# EAGLE design schematGłówny (EAGLE 8.7.0)
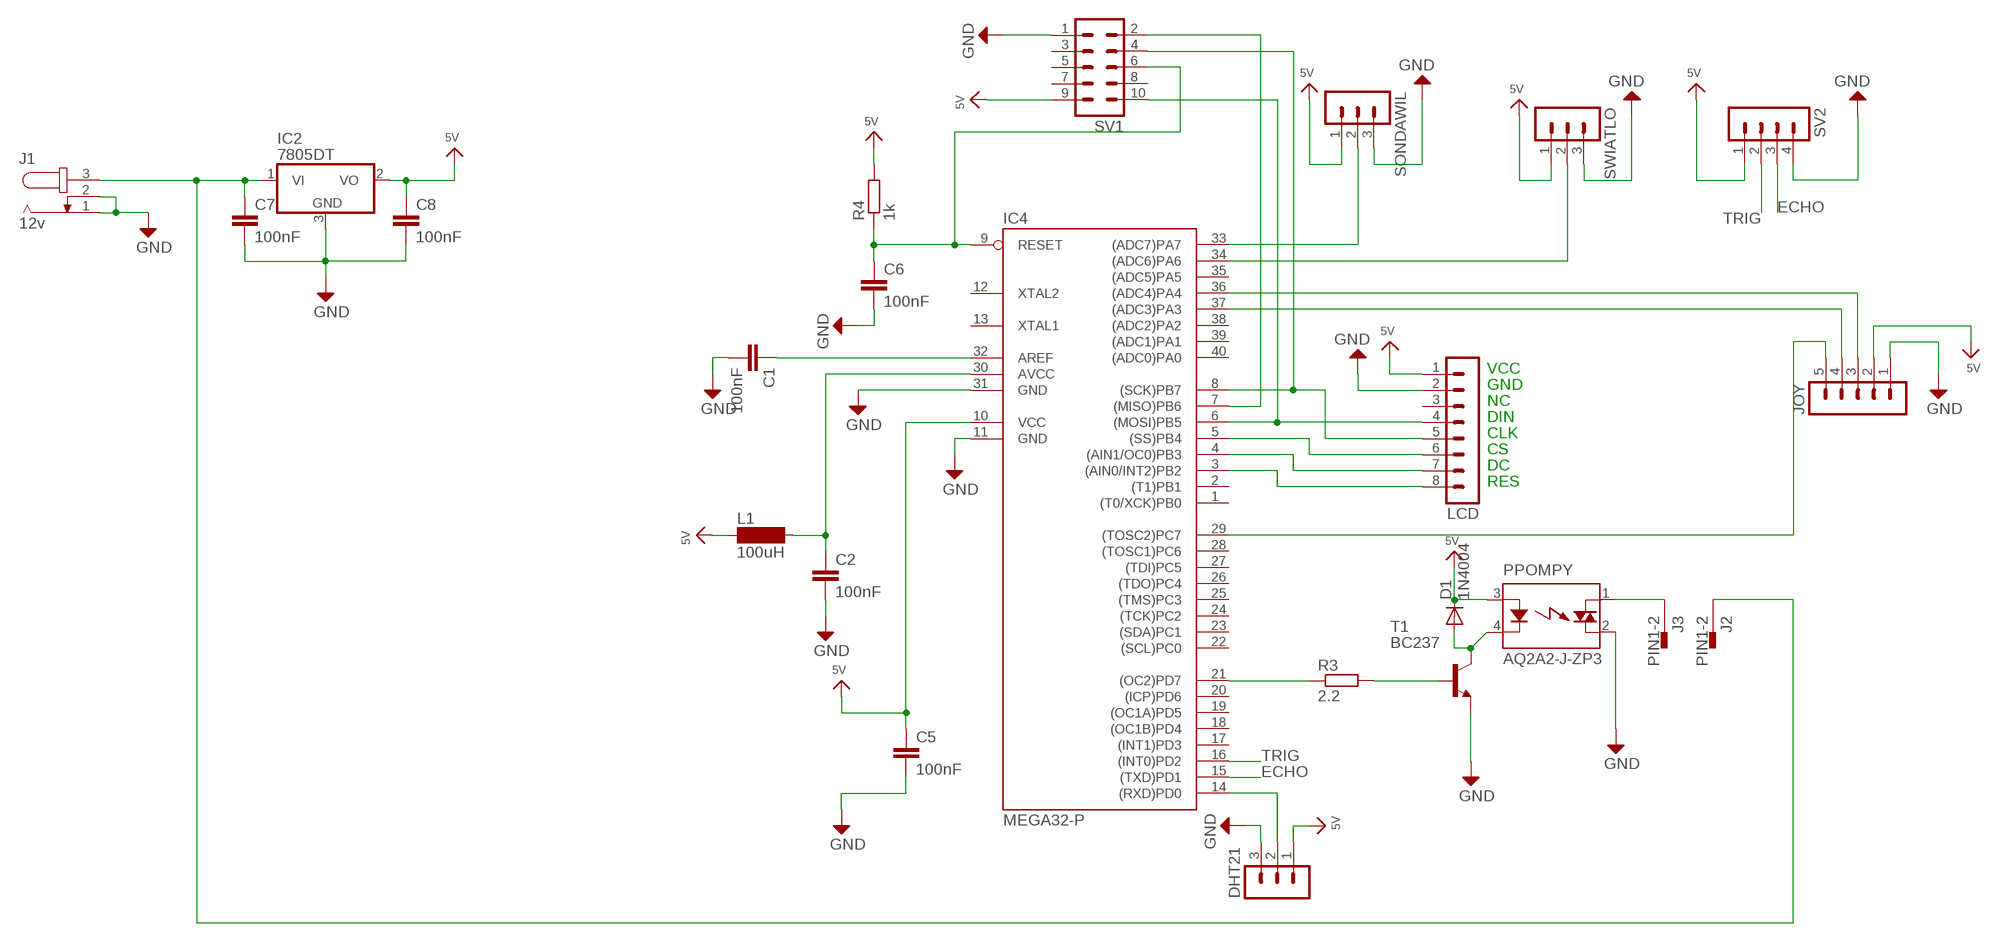
[diagram p0: schematic, sheet 1]

## Parts
C1  100nF  C2.5/6  [C2.5-6]
C2  100nF  C2.5/6  [C2.5-6]
C5  100nF  C2.5/6  [C2.5-6]
C6  100nF  C2.5/6  [C2.5-6]
C7  100nF  C2.5/6  [C2.5-6]
C8  100nF  C2.5/6  [C2.5-6]
D1  1N4004  [DO41-10]
DHT21  MA03-1  [MA03-1]
IC2  7805DT  [TO252]
IC4  MEGA32-P  [DIL40]
J1  12v  JACK-PLUG1  [SPC4078]
J2  PIN1-2  [62221]
J3  PIN1-2  [62221]
JOY  MA05-1  [MA05-1]
L1  100uH  BS75  [BS75]
LCD  MA08-1  [MA08-1]
PPOMPY  AQ2A2-J-ZP3  [AQ1-FLAT]
R3  2.2  R-EU_0207/15  [0207/15]
R4  1k  R-EU_0207/15  [0207/15]
SONDAWIL  MA03-1  [MA03-1]
SV1  MA05-2  [MA05-2]
SV2  MA04-1  [MA04-1]
SWIATLO  MA03-1  [MA03-1]
T1  BC237  [TO92]

## Nets
ECHO: IC4.15((TXD)PD1) SV2.3
GND: C1.2 C2.2 C5.2 C6.2 C7.2 C8.2 DHT21.3 IC2.3(GND) IC4.11(GND) IC4.31(GND) J1.1 J1.2 JOY.1 LCD.2 PPOMPY.2(DS2) SONDAWIL.3 SV1.1 SV2.4 SWIATLO.3 T1.1(E)
N$2: C6.1 IC4.9(RESET) R4.1 SV1.6
N$3: IC4.6((MOSI)PB5) LCD.4 SV1.10
N$4: C1.1 IC4.32(AREF)
N$5: C2.1 IC4.30(AVCC) L1.2
N$6: IC4.8((SCK)PB7) LCD.5 SV1.4
N$7: IC4.5((SS)PB4) LCD.6
N$8: IC4.4((AIN1/OC0)PB3) LCD.7
N$9: IC4.3((AIN0/INT2)PB2) LCD.8
N$10: DHT21.2 IC4.14((RXD)PD0)
N$12: IC4.33((ADC7)PA7) SONDAWIL.2
N$13: IC4.34((ADC6)PA6) SWIATLO.2
N$14: IC4.21((OC2)PD7) R3.1
N$15: R3.2 T1.2(B)
N$16: IC4.29((TOSC2)PC7) JOY.5
N$17: IC4.37((ADC3)PA3) JOY.4
N$18: IC4.36((ADC4)PA4) JOY.3
N$19: D1.A PPOMPY.4(K) T1.3(C)
N$20: IC4.7((MISO)PB6) SV1.2
N$22: J3.1 PPOMPY.1(DS1)
N$24: C7.1 IC2.1(VI) J1.3 J2.1
TRIG: IC4.16((INT0)PD2) SV2.2
VCC: C5.1 C8.1 D1.C DHT21.1 IC2.2(VO) IC4.10(VCC) JOY.2 L1.1 LCD.1 PPOMPY.3(A) R4.2 SONDAWIL.1 SV1.9 SV2.1 SWIATLO.1 ; supply symbol labelled 5V
Unconnected: IC4.1((T0/XCK)PB0) IC4.2((T1)PB1) IC4.12(XTAL2) IC4.13(XTAL1) IC4.17((INT1)PD3) IC4.18((OC1B)PD4) IC4.19((OC1A)PD5) IC4.20((ICP)PD6) IC4.22((SCL)PC0) IC4.23((SDA)PC1) IC4.24((TCK)PC2) IC4.25((TMS)PC3) IC4.26((TDO)PC4) IC4.27((TDI)PC5) IC4.28((TOSC1)PC6) IC4.35((ADC5)PA5) IC4.38((ADC2)PA2) IC4.39((ADC1)PA1) IC4.40((ADC0)PA0) LCD.3 SV1.3 SV1.5 SV1.7 SV1.8

## Notes on the sheet
- VCC
- GND
- NC
- DIN
- CLK
- CS
- DC
- RES

## Library data of the parts
C1 C2 C5-C8 = capacitor-wima:C: CAPACITOR naming: grid - package width
D1 = diode:1N4004: DIODE general purpose rectifier, 1 A
DHT21 SONDAWIL SWIATLO = con-lstb:MA03-1: PIN HEADER; OC_FARNELL: unknown; OC_NEWARK: unknown
IC2 = linear:78*: Positive VOLTAGE REGULATOR Source: http://cache.national.com/ds/LM/LM78L05.pdf http://www.fairchildsemi.com/ds/LM/LM7805.pdf
IC4 = atmel:MEGA32-P: MICROCONTROLLER 32 Kbytes FLASH 2 Kbytes SRAM 1 Kbytes EEPROM USART 8-channel 10 bit ADC Source: www.atmel.com .. doc2503.pdf; MPN: ATMEGA32-16PU; OC_FARNELL: 1661729; OC_NEWARK: 51P1794
J1 = con-jack:JACK-PLUG: DC POWER JACK Power Jack, DC, Right Angle, Through Hole, Rated 5A at 16VDC, PC Terminals Distributor: Farnell (www.Farnell.de) Drawing: 84N1161.pdf / 84N1162.pdf Manufacturer: SPC Technology (www.spctechnology.com) Type: SPC4077 / SPC 4078; OC_FARNELL: unknown; OC_NEWARK: unknown
J2 J3 = con-faston:PIN1-2: CONN TAB FASTON BRASS .187 PCB TAB, FSSTON, DUAL STAKE, .187 SERIES Digi-Key Part Number: A24734CT-ND Source: Tyco Electronics Corporation .. ENG_CD_62221_R.pdf http://search.digikey.com/scripts/DkSearch/dksus.dll?Detail&name=A24734CT-ND; MF: TYCO ELECTRONICS; MPN: 62221-1; OC_FARNELL: unknown; OC_NEWARK: 16H2318
JOY = con-lstb:MA05-1: PIN HEADER; OC_FARNELL: unknown; OC_NEWARK: unknown
L1 = inductor-neosid:BS: INDUCTOR nominal inductance, magnetically screened; OC_FARNELL: unknown; OC_NEWARK: unknown
LCD = con-lstb:MA08-1: PIN HEADER; OC_FARNELL: unknown; OC_NEWARK: unknown
PPOMPY = relay:AQ?: SOLID STATE RELAY NAiS Source: http://www.mew-europe.com/.. en_ds_61601_0000.pdf; MPN: AQ2A2-ZP3/28VDC; OC_FARNELL: 1163552; OC_NEWARK: 13P1232
R3 R4 = rcl:R-EU_: RESISTOR, European symbol; SPICEPREFIX: R
SV1 = con-lstb:MA05-2: PIN HEADER; OC_FARNELL: unknown; OC_NEWARK: unknown
SV2 = con-lstb:MA04-1: PIN HEADER; OC_FARNELL: unknown; OC_NEWARK: unknown
T1 = transistor:BC237: NPN TRANSISTOR

## Board
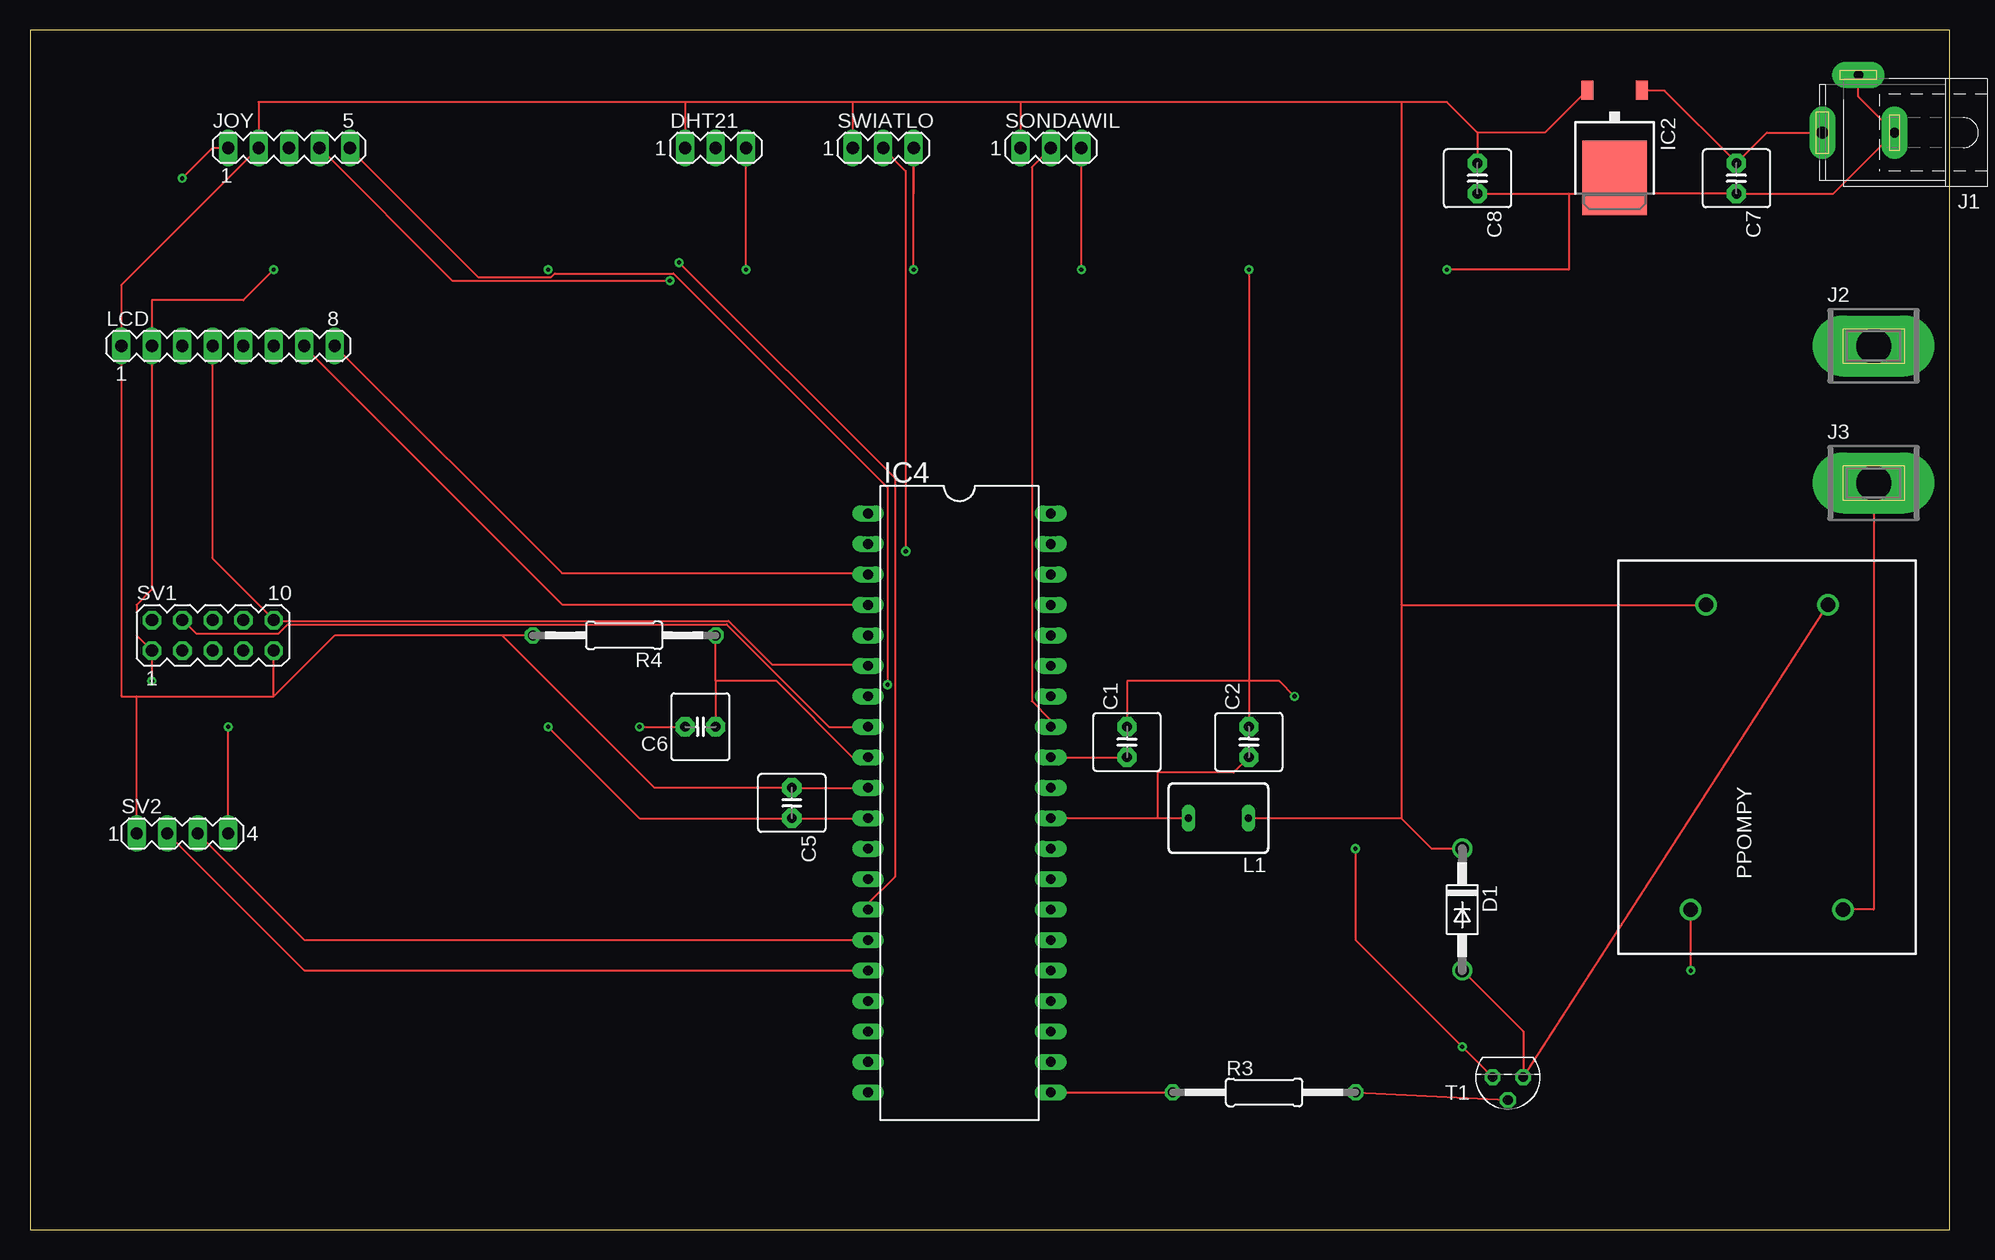
[diagram p1: board, top side]
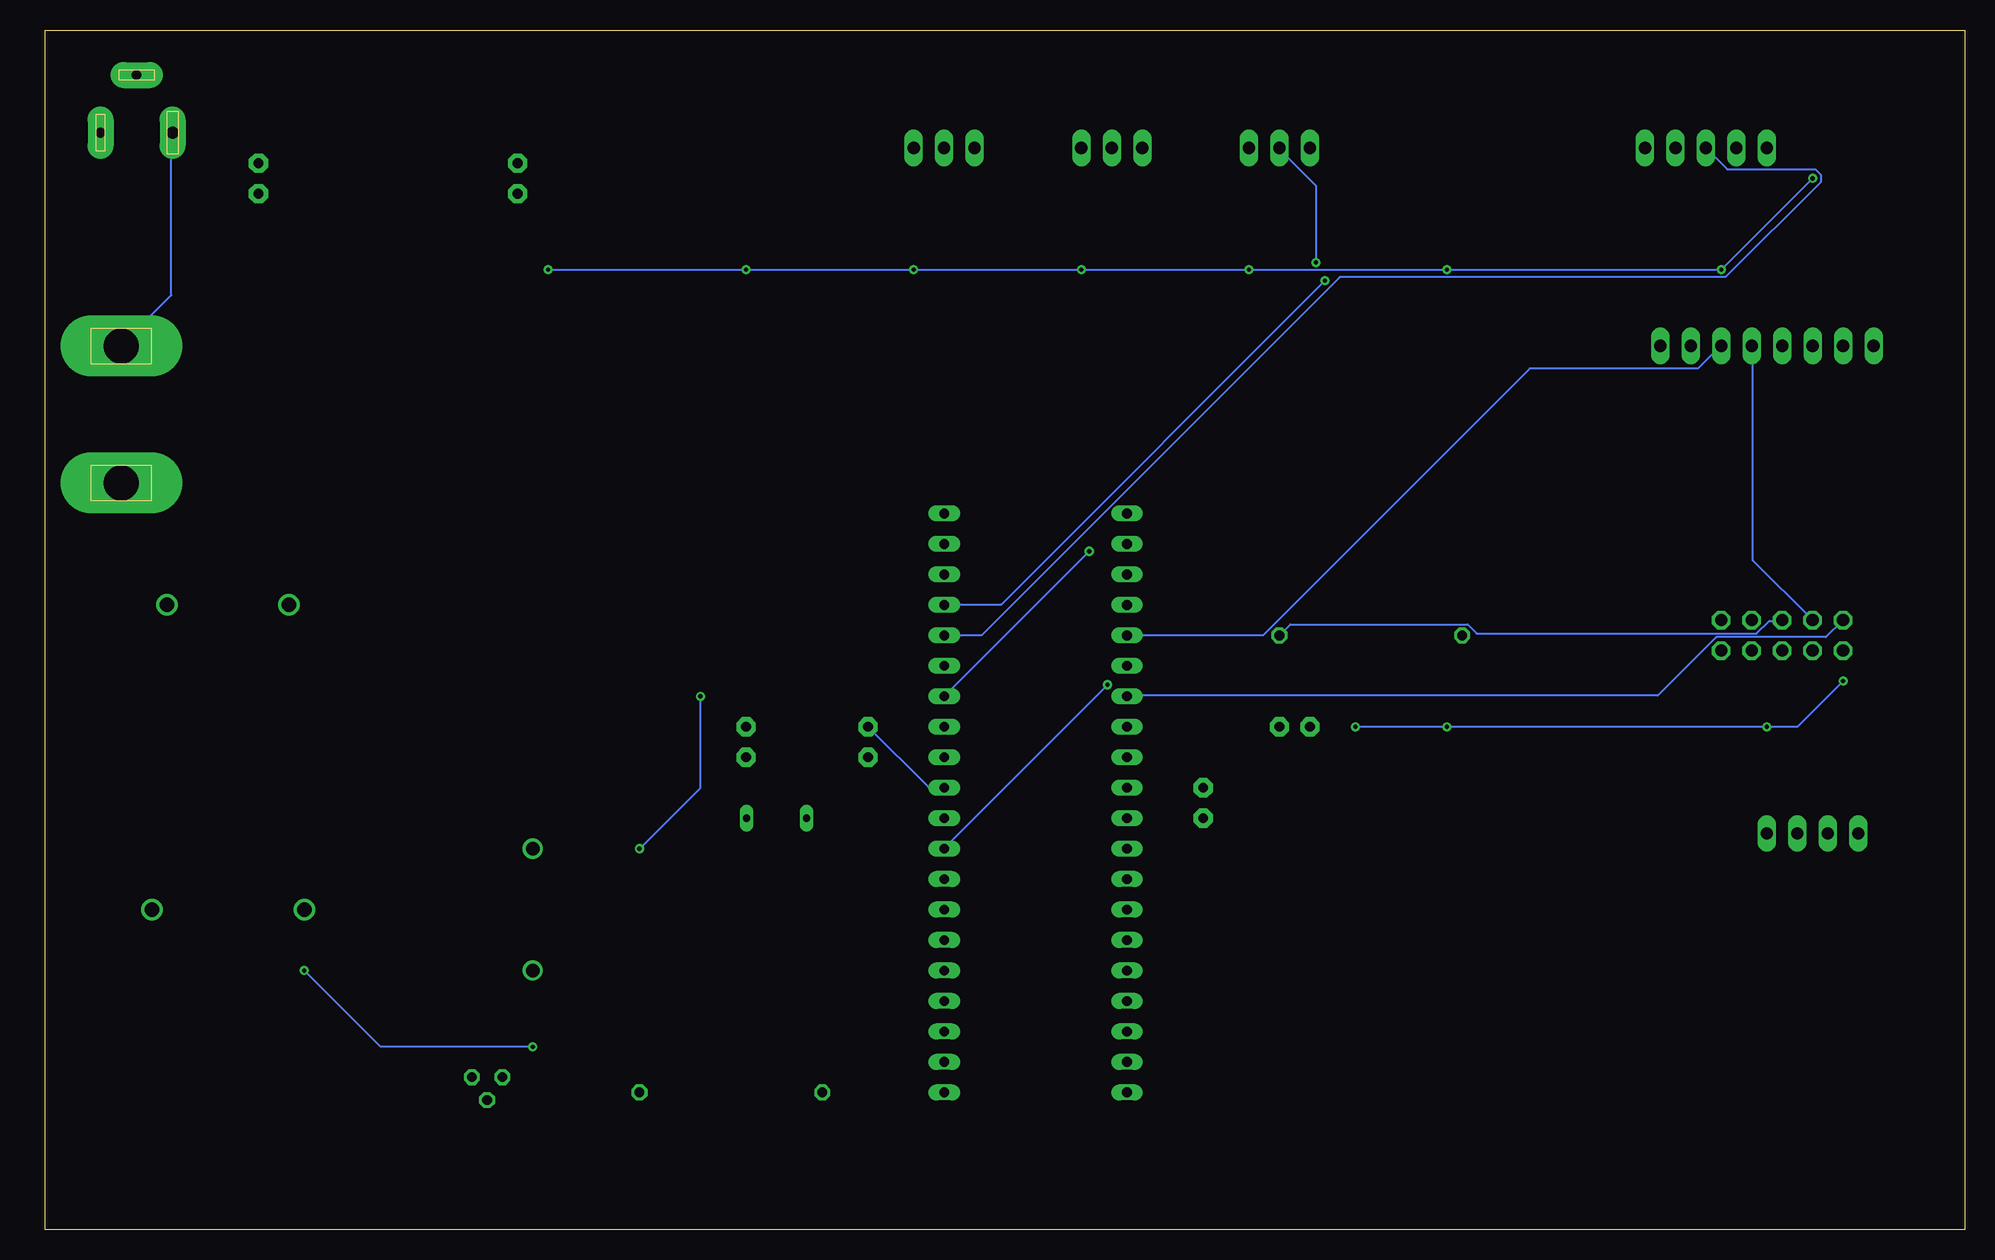
[diagram p2: board, bottom side, seen from below]

Size 160 x 100 mm. Coordinates in mm from the lower left corner, seen from the top.
Outline: 0,0 160,0 160,100 0,100 0,0
Copper layers (1*16): Top 0.035mm / dielectric 1.5mm / Bottom 0.035mm
Design rules "default": minimum track width 6mil, minimum drill 0.35mm, track to track 6mil, track to pad 6mil, pad to pad 6mil, via to via 6mil, smd to smd 6mil, copper to edge 40mil, drill to drill 6mil, minimum pad ring 10mil, minimum via ring 8mil, stop-mask expansion 4mil, vias tented up to drill 0mil, thermal gap 10mil

### Footprints (pad centres in the part's own frame; a part is rotated, then mirrored left to right if it is on the bottom)
C2.5-6 = drill 0.813 pad 1.6 octagon: 1 -1.27,0; 2 1.27,0
DO41-10 = drill 1.118: A 5.08,0; C -5.08,0
MA03-1 = drill 1.016 long: 1 -2.54,0; 2 0,0; 3 2.54,0
TO252 = smd 1 x 1.6: 1 -2.28,-4.8; 2 2.28,-4.8 | smd 5.4 x 6.2: 3 0,2.5
DIL40 = drill 0.813 long: 1 -24.13,-7.62; 2 -21.59,-7.62; 3 -19.05,-7.62; 4 -16.51,-7.62; 5 -13.97,-7.62; 6 -11.43,-7.62; 7 -8.89,-7.62; 8 -6.35,-7.62; 9 -3.81,-7.62; 10 -1.27,-7.62; 11 1.27,-7.62; 12 3.81,-7.62; 13 6.35,-7.62; 14 8.89,-7.62; 15 11.43,-7.62; 16 13.97,-7.62; 17 16.51,-7.62; 18 19.05,-7.62; 19 21.59,-7.62; 20 24.13,-7.62; 21 24.13,7.62; 22 21.59,7.62; 23 19.05,7.62; 24 16.51,7.62; 25 13.97,7.62; 26 11.43,7.62; 27 8.89,7.62; 28 6.35,7.62; 29 3.81,7.62; 30 1.27,7.62; 31 -1.27,7.62; 32 -3.81,7.62; 33 -6.35,7.62; 34 -8.89,7.62; 35 -11.43,7.62; 36 -13.97,7.62; 37 -16.51,7.62; 38 -19.05,7.62; 39 -21.59,7.62; 40 -24.13,7.62
SPC4078 = drill 0.8 pad 2.184 long: 1 -3,0; 2 0,-4.8 | drill 1 pad 2.184 long: 3 3,0
62221 = drill 2.921 pad 5.08 long: 1 0,0
MA05-1 = drill 1.016 long: 1 -5.08,0; 2 -2.54,0; 3 0,0; 4 2.54,0; 5 5.08,0
BS75 = drill 0.6 long: 1 -2.5,0; 2 2.5,0
MA08-1 = drill 1.016 long: 1 -8.89,0; 2 -6.35,0; 3 -3.81,0; 4 -1.27,0; 5 1.27,0; 6 3.81,0; 7 6.35,0; 8 8.89,0
AQ1-FLAT = drill 1.2: 1 -12.7,-6.35; 2 -12.7,6.35; 3 12.7,5.08; 4 12.7,-5.08
0207/15 = drill 0.813 octagon: 1 -7.62,0; 2 7.62,0
MA05-2 = drill 1.016 octagon: 1 -5.08,-1.27; 2 -5.08,1.27; 3 -2.54,-1.27; 4 -2.54,1.27; 5 0,-1.27; 6 0,1.27; 7 2.54,-1.27; 8 2.54,1.27; 9 5.08,-1.27; 10 5.08,1.27
MA04-1 = drill 1.016 long: 1 -3.81,0; 2 -1.27,0; 3 1.27,0; 4 3.81,0
TO92 = drill 0.813 octagon: 1 1.27,0; 2 0,1.905; 3 -1.27,0

### Placement (x,y rotation side)
C1  91.44,40.64 90 top
C2  101.6,40.64 90 top
C5  63.5,35.56 270 top
C6  55.88,41.91 180 top
C7  142.24,87.63 270 top
C8  120.65,87.63 270 top
D1  119.38,26.67 270 top
DHT21  57.15,90.17 0 top
IC2  132.08,90.17 180 top
IC4  77.47,35.56 270 top
J1  152.4,91.44 180 top
J2  153.67,73.66 0 top
J3  153.67,62.23 0 top
JOY  21.59,90.17 0 top
L1  99.06,34.29 180 top
LCD  16.51,73.66 0 top
PPOMPY  144.78,39.37 90 top
R3  102.87,11.43 0 top
R4  49.53,49.53 180 top
SONDAWIL  85.09,90.17 0 top
SV1  15.24,49.53 0 top
SV2  12.7,33.02 0 top
SWIATLO  71.12,90.17 0 top
T1  123.19,12.7 180 top

### Tracks (layer width: path | path; a pad name or v marks a point on that pad's centre or on a via)
ECHO
  Top 0.152: SV2.3 22.86,24.13 IC4.15
GND  (via drill 0.35)
  Top 0.152: IC4.11 C5.2 50.8,34.29 v43.18,41.91 | J1.2 152.4,94.44 J1.1 150.32,86.36 C7.2 133.39,86.36 IC2.3 132.08,87.63 130.81,86.36 128.27,86.36 | C8.2 128.27,86.36 | 73.66,86.36 SWIATLO.3 v73.66,80.01 | 128.27,86.36 128.27,80.01 v118.11,80.01 | v87.63,80.01 SONDAWIL.3 | v59.69,80.01 DHT21.3 | v12.7,87.63 15.24,90.17 JOY.1 | v20.32,80.01 17.78,77.47 10.16,77.47 LCD.2 10.16,53.34 8.89,52.07 8.89,49.53 SV1.1 v10.16,45.72 | v50.8,41.91 C6.2 | v101.6,80.01 101.6,45.72 | 101.6,45.72 C2.2 | 101.6,45.72 91.44,45.72 C1.2 | T1.1 v119.38,15.24 110.49,24.13 v110.49,31.75 | v105.41,44.45 104.14,45.72 101.6,45.72 | v138.43,21.59 PPOMPY.2 | SV2.4 v16.51,41.91
  Bottom 0.152: v12.7,87.63 v20.32,80.01 v43.18,80.01 v59.69,80.01 v73.66,80.01 v87.63,80.01 v101.6,80.01 v118.11,80.01 | v10.16,45.72 13.97,41.91 v16.51,41.91 v43.18,41.91 v50.8,41.91 | v110.49,31.75 105.41,36.83 v105.41,44.45 | v119.38,15.24 132.08,15.24 v138.43,21.59 | C1.2 86.41,36.88 85.19,36.88 IC4.31
  other vias: 91.44,41.91 85.09,36.83
N$2
  Top 0.152: IC4.9 68.58,39.37 62.23,45.72 57.15,45.72 | 57.15,45.72 R4.1 | 57.15,45.72 C6.1
  Bottom 0.152: R4.1 56.24,50.44 41.45,50.44 40.69,49.68 17.37,49.68 16.31,50.75 15.24,50.75 SV1.6
N$3
  Top 0.152: IC4.6 69.8,47.09 61.87,47.09 58.22,50.75 20.42,50.75 SV1.10 20.27,50.9 15.24,55.93 LCD.4
N$4
  Top 0.152: IC4.32 C1.1
N$5
  Top 0.152: L1.2 93.98,34.29 | 93.98,34.29 IC4.30 | C2.1 100.33,38.1 93.98,38.1 93.98,34.29
N$6  (via drill 0.35)
  Top 0.152: IC4.8 66.6,41.91 58.06,50.44 21.49,50.44 20.73,49.68 13.87,49.68 12.8,50.75 SV1.4
  Bottom 0.152: SV1.4 17.68,55.78 17.68,73.61 LCD.5
  other vias: 12.7,50.8 17.78,73.66
N$7  (via drill 0.35)
  Bottom 0.152: IC4.5 58.52,49.53 36.27,71.78 22.25,71.78 20.42,73.61 LCD.6
  other vias: 69.85,49.53 20.32,73.66
N$8
  Top 0.152: IC4.4 69.8,52.12 44.35,52.12 22.86,73.61 LCD.7
N$9
  Top 0.152: LCD.8 44.35,54.71 69.8,54.71 IC4.3
N$10  (via drill 0.35)
  Top 0.152: v54.1,80.62 72.08,62.64 72.08,29.41 69.95,27.28 69.95,26.67 IC4.14
  Bottom 0.152: v54.1,80.62 54.1,87.02 57.15,90.07 DHT21.2
  other vias: 57.15,90.17
N$12
  Top 0.152: IC4.33 85.04,41.91 85.04,42.52 83.52,44.04 83.52,88.54 85.04,90.07 SONDAWIL.2
N$13  (via drill 0.35)
  Top 0.152: v73,56.54 73,88.24 71.17,90.07 SWIATLO.2
  Bottom 0.152: v73,56.54 IC4.34
  other vias: 85.09,44.45
N$14
  Top 0.152: IC4.21 R3.1
N$15
  Top 0.152: R3.2 T1.2
N$16  (via drill 0.35)
  Top 0.152: v71.48,45.41 71.48,61.87 53.65,79.7 43.74,79.7 43.43,79.4 37.34,79.4 26.67,90.07 JOY.5
  Bottom 0.152: v71.48,45.41 85.04,31.85 IC4.29
  other vias: 85.09,31.75
N$17  (via drill 0.35)
  Top 0.152: v53.34,79.1 35.2,79.1 JOY.4
  Bottom 0.152: v53.34,79.1 80.31,52.12 85.04,52.12 IC4.37
  other vias: 85.09,52.07
N$18  (via drill 0.35)
  Bottom 0.152: IC4.36 81.99,49.53 52.12,79.4 19.96,79.4 12.04,87.33 12.04,87.94 12.5,88.39 19.81,88.39 JOY.3
  other vias: 85.09,49.53 21.59,90.17
N$19
  Top 0.152: PPOMPY.4 T1.3 124.46,16.51 D1.A
N$20  (via drill 0.35)
  Bottom 0.152: SV1.2 11.58,49.38 20.73,49.38 25.6,44.5 69.8,44.5 IC4.7
  other vias: 69.85,44.45 10.16,50.8
N$22
  Top 0.152: J3.1 153.67,26.67 PPOMPY.1
N$24  (via drill 0.35)
  Top 0.152: IC2.1 134.42,94.94 136.25,94.94 142.19,89 C7.1 144.78,91.44 J1.3
  Bottom 0.152: J1.3 149.5,91.44 149.5,77.88 153.62,73.76 J2.1
  other vias: 153.67,73.66
TRIG
  Top 0.152: SV2.2 22.86,21.59 IC4.16
VCC
  Top 0.152: IC4.10 C5.1 52.07,36.83 39.37,49.53 | IC2.2 126.27,91.44 120.65,91.44 | 120.65,91.44 C8.1 | 120.65,91.44 118.11,93.98 114.3,93.98 | 114.3,93.98 82.55,93.98 | 82.55,93.98 SONDAWIL.1 | 82.55,93.98 68.58,93.98 | 68.58,93.98 SWIATLO.1 | 68.58,93.98 54.61,93.98 | 54.61,93.98 DHT21.1 | 54.61,93.98 19.05,93.98 JOY.2 7.62,78.74 LCD.1 7.62,44.45 8.89,44.45 | 8.89,44.45 20.32,44.45 | 20.32,44.45 SV1.9 | 114.3,52.07 PPOMPY.3 | 114.3,93.98 114.3,52.07 | 114.3,52.07 114.3,34.29 | 114.3,34.29 L1.1 | R4.2 39.37,49.53 | 39.37,49.53 25.4,49.53 20.32,44.45 | D1.C 116.84,31.75 114.3,34.29 | SV2.1 8.89,44.45